# EAGLE design sebix_esquematico (EAGLE 9.6.2)
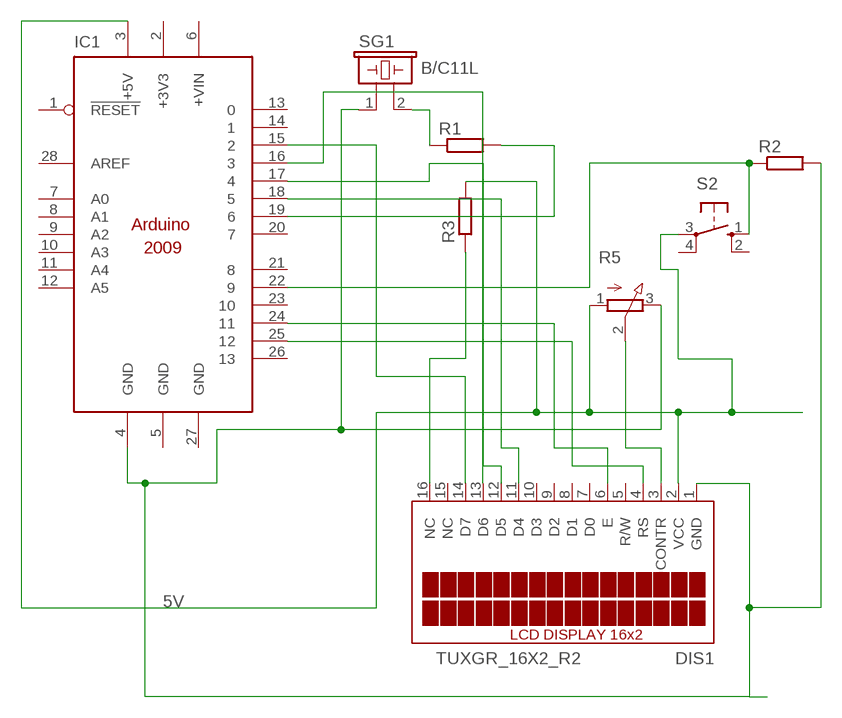
[diagram p0: schematic, sheet 1]

## Parts
DIS1  TUXGR_16X2_R2  [TUXGR_16X2_R2]
IC1  ARDUINO2009_10  [ARDUINO2009]
R1  R-EU_0207/10  [0207/10]
R2  R-EU_0207/10  [0207/10]
R3  R-EU_0204/7  [0204/7]
R5  3RP/1610N  [3RP/1610N]
S2  10-XX  [B3F-10XX]
SG1  B/C11L  [B/C11L]

## Nets
5V: DIS1.2(VCC) IC1.3(+5V) R3.2 R5.1(A) S2.3(P)
N$1: DIS1.16(NC) R3.1
N$2: DIS1.3(CONTR) R5.2(S)
N$4: R1.1 SG1.2
N$5: DIS1.4(RS) IC1.25
N$6: DIS1.6(E) IC1.24
N$7: DIS1.11(D4) IC1.18
N$8: DIS1.12(D5) IC1.17
N$9: IC1.19 R1.2
N$10: DIS1.13(D6) IC1.16
N$11: DIS1.14(D7) IC1.15
N$12: IC1.22 R2.1 S2.1(S)
N$13: DIS1.1(GND) IC1.4(GND) R2.2 R5.3(E) SG1.1
Unconnected: DIS1.5(R/W) DIS1.7(D0) DIS1.8(D1) DIS1.9(D2) DIS1.10(D3) DIS1.15(NC) IC1.1(!RESET) IC1.6(+VIN) IC1.7(A0) IC1.8(A1) IC1.9(A2) IC1.10(A3) IC1.11(A4) IC1.12(A5) IC1.13 IC1.14 IC1.20 IC1.21 IC1.23 IC1.26 IC1.28(AREF) S2.2(S1) S2.4(P1)

## Power pins joined to a net without a drawn wire
+3V3: IC1.2(+3V3)
GND: IC1.5(GND) IC1.27(GND)

## Library data of the parts
DIS1 = display-lcd:TUXGR_16X2_R2: Tuxgraphics LCD display 16x2 characters reflective, without background light Source: tuxgr_12x2_r2.pdf; OC_FARNELL: unknown; OC_NEWARK: unknown
IC1 = arduino:ARDUINO2009_1: The Arduino Duemilanove ("2009") is a microcontroller board based on the ATmega168 or ATmega328. - 14 digital input/output pins (of which 6 can be used as PWM outputs) - 6 analog inputs, a 16 MHz crystal oscillator - USB connection - power jack - ISP header - reset button It contains everything needed to support the microcontroller; simply connect it to a computer with a USB cable or power it with a AC-to-DC adapter or battery to get started http://arduino.cc/en/Main/ArduinoBoardDuemilanove
R1-R3 = rcl:R-EU_: RESISTOR, European symbol; SPICEPREFIX: R
R5 = pot:3RP/1610N: 16mm Potentiometer one level Source: http://www.alphapotentiometers.net/html/16mm_pot_2.html
S2 = switch-omron:10-XX: OMRON SWITCH; MPN: B3F-1000; OC_FARNELL: 176432; OC_NEWARK: 36M3542
SG1 = buzzer:B/C11L: BUZZER Source: Buerklin; OC_FARNELL: unknown; OC_NEWARK: unknown

## Board
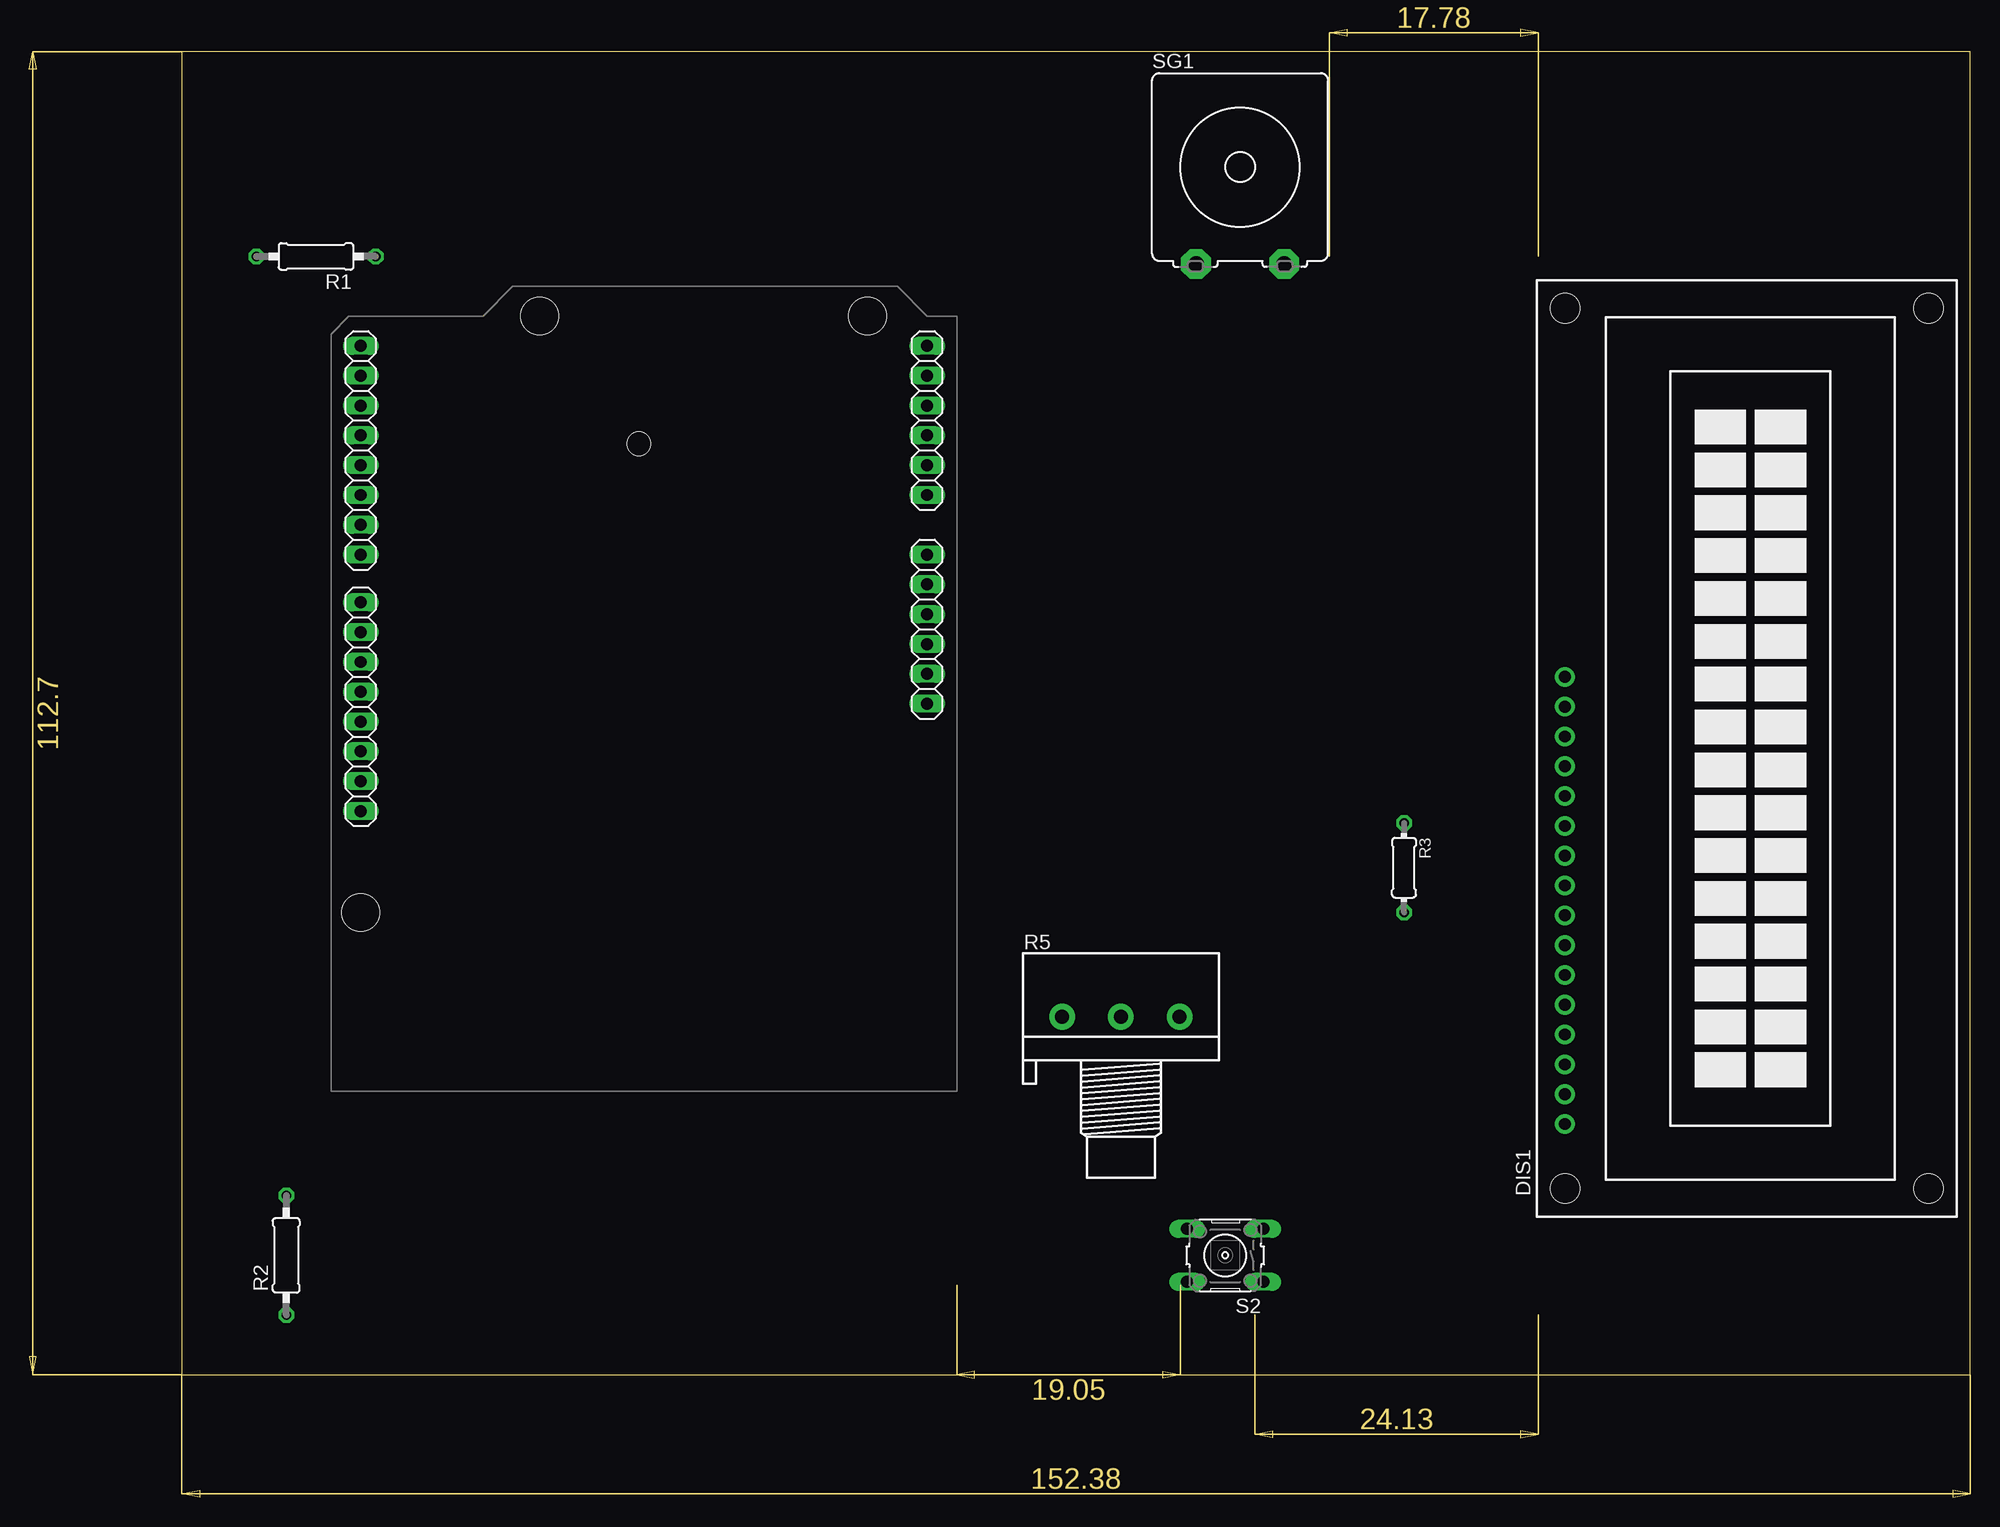
[diagram p1: board, top side]
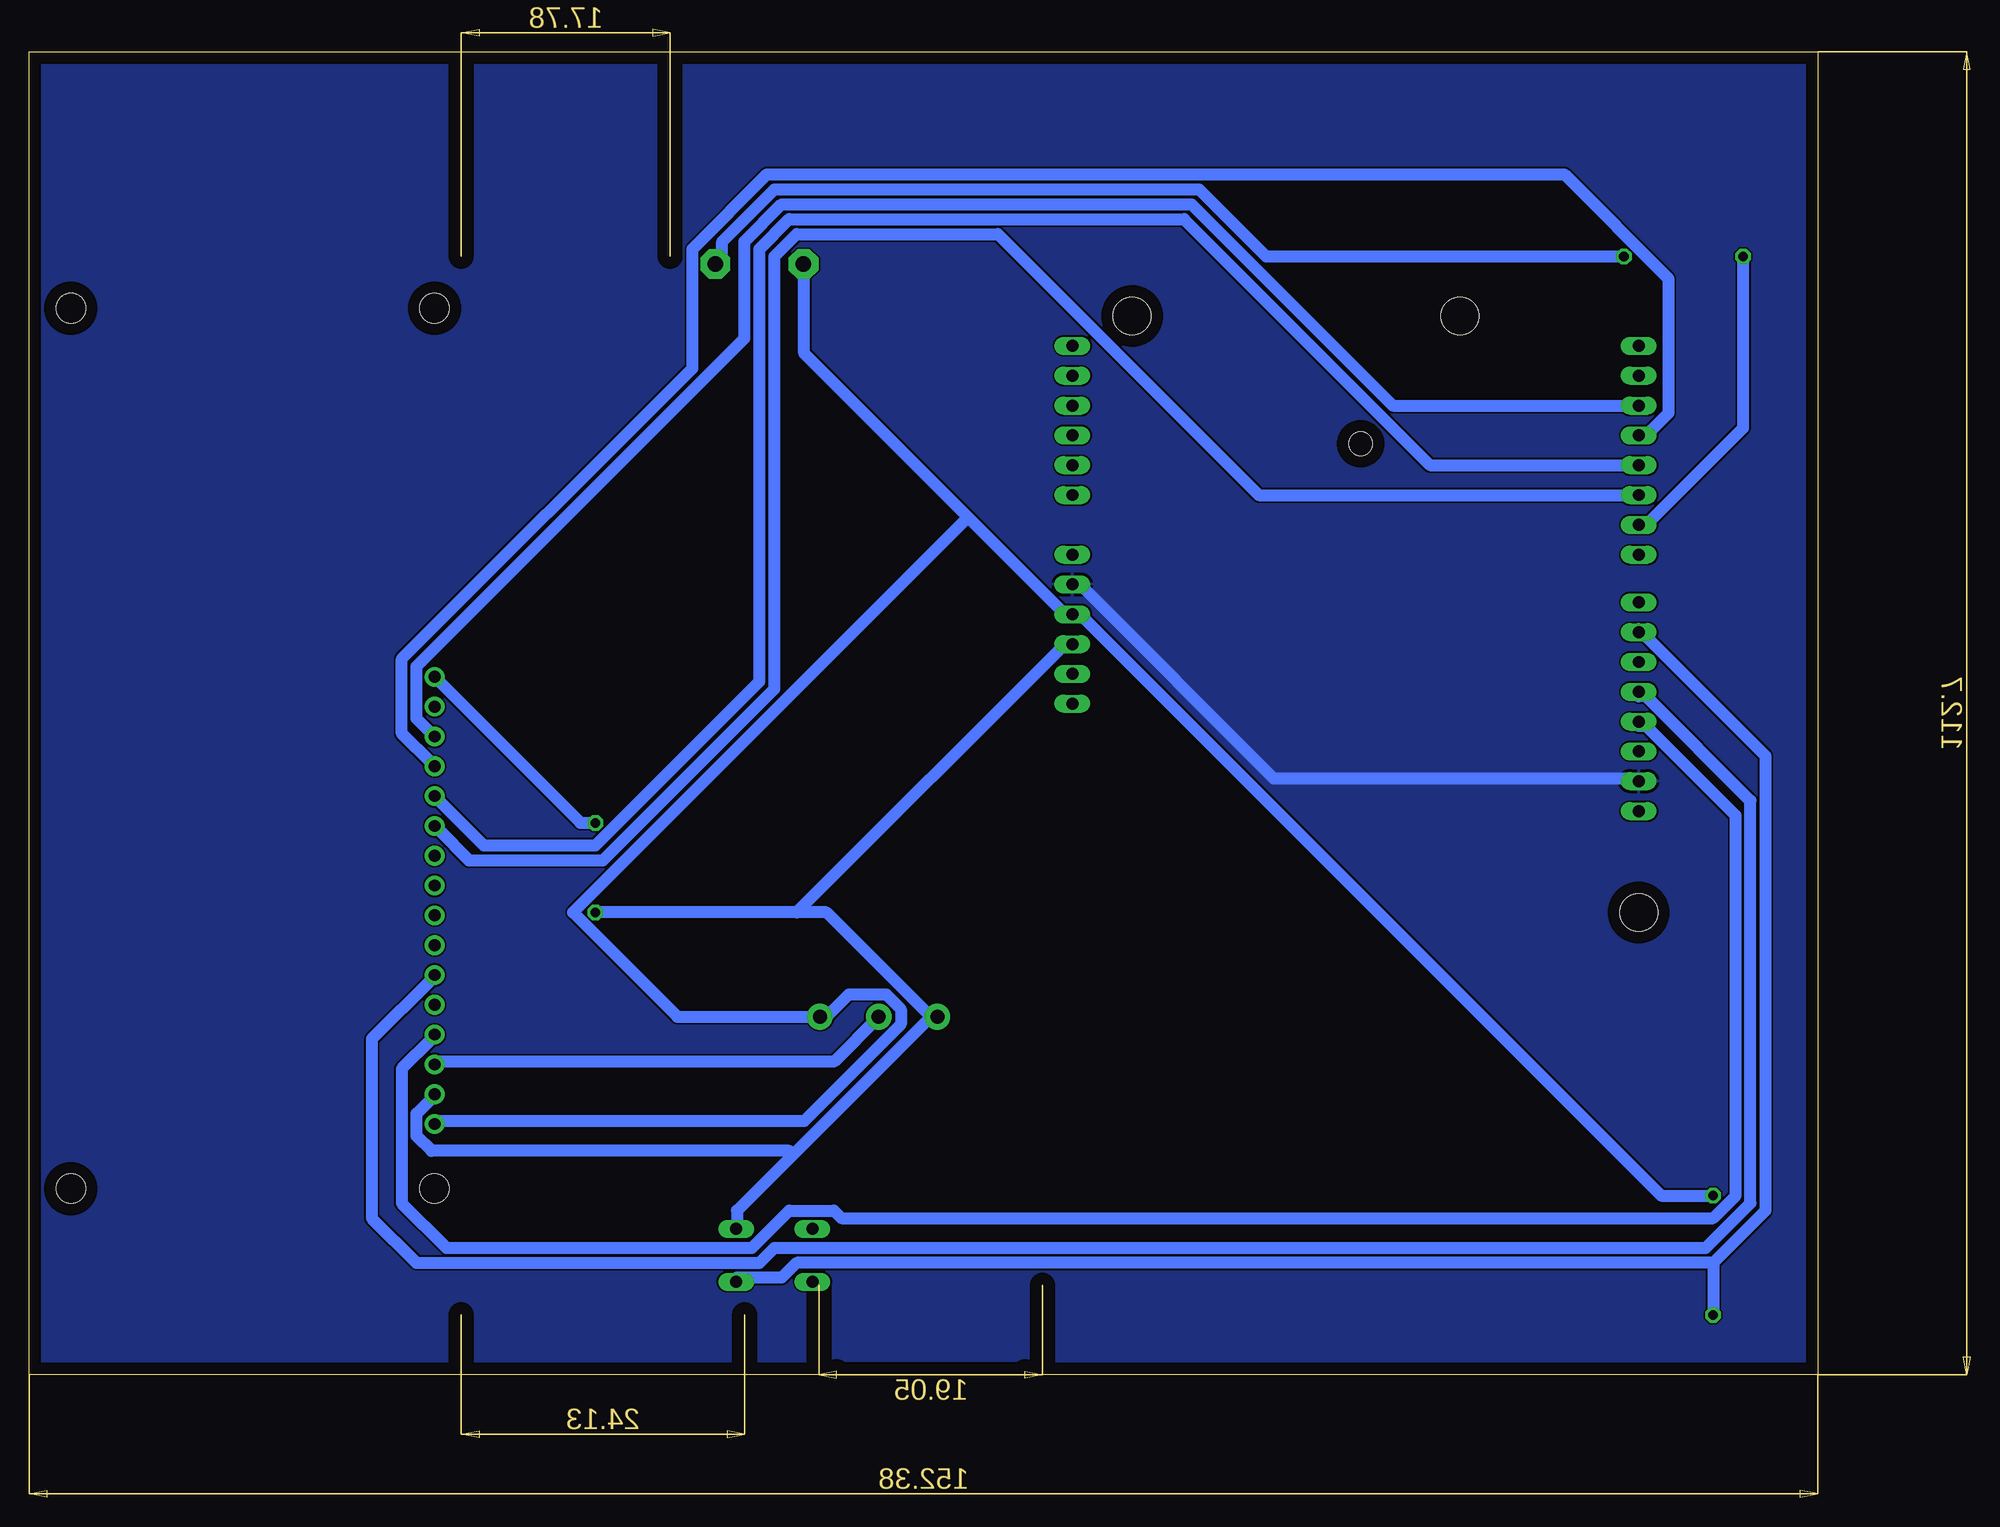
[diagram p2: board, bottom side, seen from below]

Size 152.38 x 112.7 mm. Coordinates in mm from the lower left corner, seen from the top.
Outline: 0,0 152.38,0 152.38,112.7 0,112.7 0,0
Copper layers (1*16): Top 0.035mm / dielectric 1.5mm / Bottom 0.035mm
Design rules "default *": minimum track width 40mil, minimum drill 0.35mm, track to track 6mil, track to pad 6mil, pad to pad 6mil, via to via 6mil, smd to smd 6mil, copper to edge 40mil, drill to drill 6mil, minimum pad ring 10mil, minimum via ring 8mil, stop-mask expansion 4mil, vias tented up to drill 0mil, thermal gap 10mil

### Footprints (pad centres in the part's own frame; a part is rotated, then mirrored left to right if it is on the bottom)
TUXGR_16X2_R2 = drill 1 pad 1.676: 1 -32,15.5; 2 -29.46,15.5; 3 -26.92,15.5; 4 -24.38,15.5; 5 -21.84,15.5; 6 -19.3,15.5; 7 -16.76,15.5; 8 -14.22,15.5; 9 -11.68,15.5; 10 -9.14,15.5; 11 -6.6,15.5; 12 -4.06,15.5; 13 -1.52,15.5; 14 1.02,15.5; 15 3.56,15.5; 16 6.1,15.5 | hole 2.5: -37.5,-15.5; 37.5,-15.5; -37.5,15.5; 37.5,15.5
ARDUINO2009 = drill 1.016 long: 1 33.02,2.54; 2 35.56,2.54; 3 38.1,2.54; 4 40.64,2.54; 5 43.18,2.54; 6 45.72,2.54; 7 50.8,2.54; 8 53.34,2.54; 9 55.88,2.54; 10 58.42,2.54; 11 60.96,2.54; 12 63.5,2.54; 13 63.5,50.8; 14 60.96,50.8; 15 58.42,50.8; 16 55.88,50.8; 17 53.34,50.8; 18 50.8,50.8; 19 48.26,50.8; 20 45.72,50.8; 21 41.656,50.8; 22 39.116,50.8; 23 36.576,50.8; 24 34.036,50.8; 25 31.496,50.8; 26 28.956,50.8; 27 26.416,50.8; 28 23.876,50.8 | hole 3.2: 15.24,50.8; 66.04,35.56; 66.04,7.62 | hole 2: 55.17,27.114
0207/10 = drill 0.813 octagon: 1 -5.08,0; 2 5.08,0
0204/7 = drill 0.813 octagon: 1 -3.81,0; 2 3.81,0
3RP/1610N = drill 1.2 pad 2.184: 1 -5,0; 2 0,0; 3 5,0
B3F-10XX = drill 1.016 long: 1 -3.251,2.261; 2 3.251,2.261; 3 -3.251,-2.261; 4 3.251,-2.261
B/C11L = drill 1.321 pad 2.54 octagon: 1 -3.759,-8.255; 2 3.759,-8.255

### Placement (x,y rotation side)
DIS1  133.35,53.34 90 top
IC1  66.04,24.13 90 top
R1  11.43,95.25 180 top
R2  8.89,10.16 90 top
R3  104.14,43.18 270 top
R5  80.01,30.48 0 top
S2  88.9,10.16 180 top
SG1  90.17,102.87 0 top

### Tracks (layer width: path | path; a pad name or v marks a point on that pad's centre or on a via)
5V
  Bottom 1.016: 87,39.37 84.45,39.37 75.56,30.48 | 87,39.37 R3.2 | 75.56,30.48 87.31,18.73 | 87.31,18.73 92.08,13.97 92.08,12.7 S2.3 | 75.56,30.48 R5.1 | IC1.3 64.13,62.23 87,39.37 | DIS1.2 118.11,23.49 119.38,22.23 119.38,20.32 118.11,19.05 87.63,19.05 87.31,18.73
GND
  Bottom 1.016: IC1.5 62.87,67.31 46.36,50.8 15.24,50.8 IC1.27
  pour Bottom: 0,113.03 0,0 152.4,0 152.4,113.03
N$1
  Bottom 1.016: R3.1 105.41,46.99 117.47,59.05 DIS1.16
N$2
  Bottom 1.016: R5.2 83.82,26.67 117.47,26.67 DIS1.3
N$4
  Bottom 1.016: R1.1 46.99,95.25 52.7,100.97 88.9,100.97 93.34,96.52 93.34,94.62 SG1.2
N$5
  Bottom 1.016: IC1.25 15.24,55.25 14.61,55.25 6.99,47.62 6.99,15.24 8.89,13.33 83.19,13.33 83.82,13.97 87.63,13.97 90.81,10.79 116.84,10.79 120.65,14.6 120.65,26.04 118.11,28.57 DIS1.4
N$6
  Bottom 1.016: IC1.24 15.24,57.78 14.61,57.78 5.72,48.89 5.72,14.6 9.53,10.79 88.9,10.79 90.17,9.52 119.38,9.52 123.19,13.33 123.19,28.57 118.11,33.66 DIS1.6
N$7
  Bottom 1.016: IC1.18 47.62,74.93 69.85,97.16 87,97.16 88.9,95.25 88.9,58.42 103.5,43.81 114.94,43.81 117.47,46.36 DIS1.11
N$8
  Bottom 1.016: IC1.17 33.02,77.47 53.98,98.42 87.63,98.42 90.17,95.89 90.17,59.05 104.14,45.08 113.67,45.08 117.47,48.89 DIS1.12
N$9
  Bottom 1.016: R1.2 6.35,80.64 14.61,72.39 IC1.19
N$10
  Bottom 1.016: IC1.16 14.61,80.01 12.7,81.92 12.7,93.34 21.59,102.23 89.53,102.23 95.89,95.89 95.89,85.73 120.65,60.96 120.65,54.61 118.11,52.07 DIS1.13
N$11
  Bottom 1.016: IC1.15 36.2,82.55 53.34,99.7 88.27,99.7 91.44,96.52 91.44,88.27 119.38,60.33 119.38,55.88 118.11,54.61 DIS1.14
N$12
  Bottom 1.016: 8.89,9.52 R2.1 | 8.89,9.52 4.45,13.97 4.45,52.7 15.24,63.5 IC1.22 | 8.89,9.52 87,9.52 88.27,8.25 92.08,8.25 S2.1
N$13
  Bottom 1.016: DIS1.1 117.47,21.59 86.36,21.59 78.11,29.84 78.11,31.11 79.38,32.38 82.55,32.38 84.45,30.48 R5.3 97.16,30.48 106.05,39.37 72.39,73.03 | R2.2 13.34,15.24 62.87,64.77 IC1.4 64.13,64.77 72.39,73.03 | 72.39,73.03 86.36,87 86.36,94.62 SG1.1